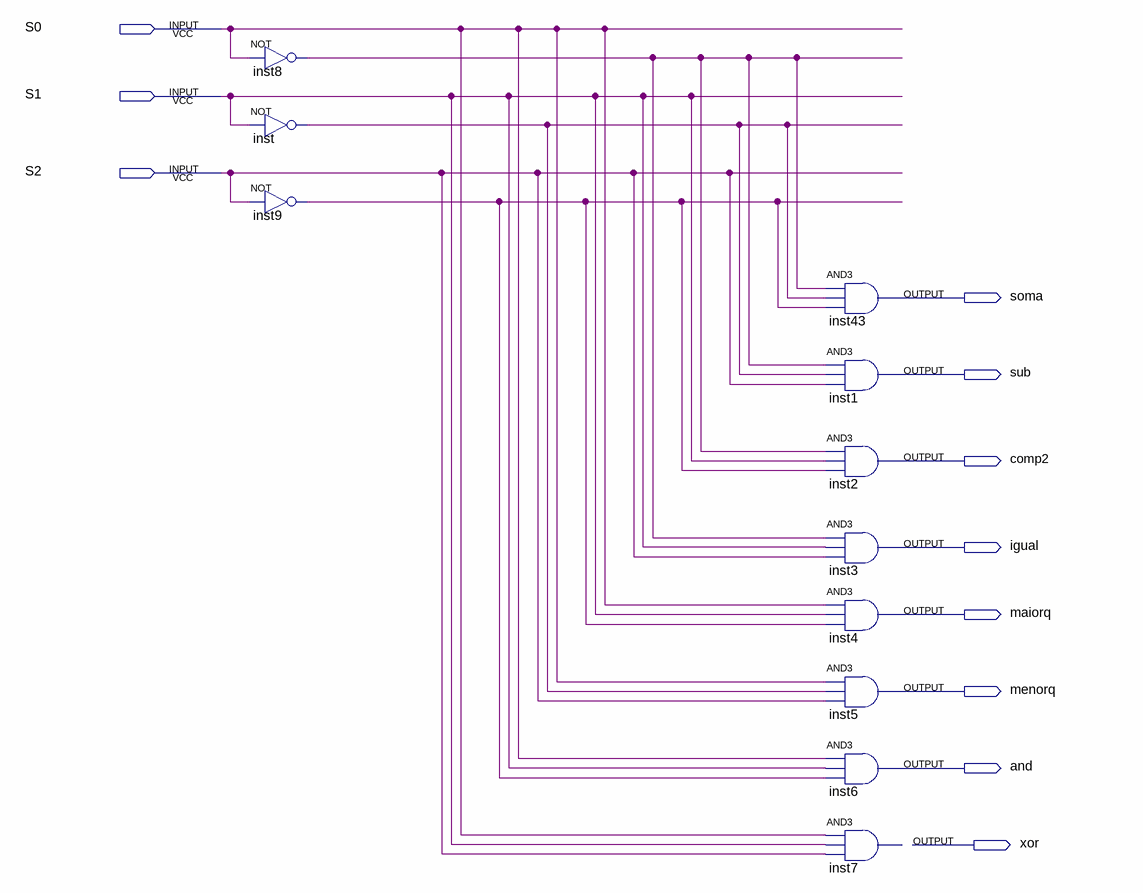
[diagram p0: schematic sheet]
// Quartus schematic SeletorOK.bdf as structural Verilog: 11 symbols, 11 pins
module SeletorOK (
  input  S0,
  input  S1,
  input  S2,
  output soma,
  output sub,
  output comp2,
  output igual,
  output maiorq,
  output menorq,
  output \and ,
  output \xor 
);

  wire inst8_out, inst9_out, inst_out;

  not inst8 (inst8_out, S0);
  not inst (inst_out, S1);
  not inst9 (inst9_out, S2);
  and inst43 (soma, inst8_out, inst_out, inst9_out);
  and inst1 (sub, inst8_out, inst_out, S2);
  and inst2 (comp2, inst8_out, S1, inst9_out);
  and inst3 (igual, inst8_out, S1, S2);
  and inst4 (maiorq, S0, S1, inst9_out);
  and inst5 (menorq, S0, inst_out, S2);
  and inst6 (\and , S0, S1, inst9_out);
  // AND3 inst7 has open pins: IN1=S0, IN2=S1, IN3=S2, OUT=open
endmodule
